# Altium schematic sheet Atmega328P.SchDoc
size A4
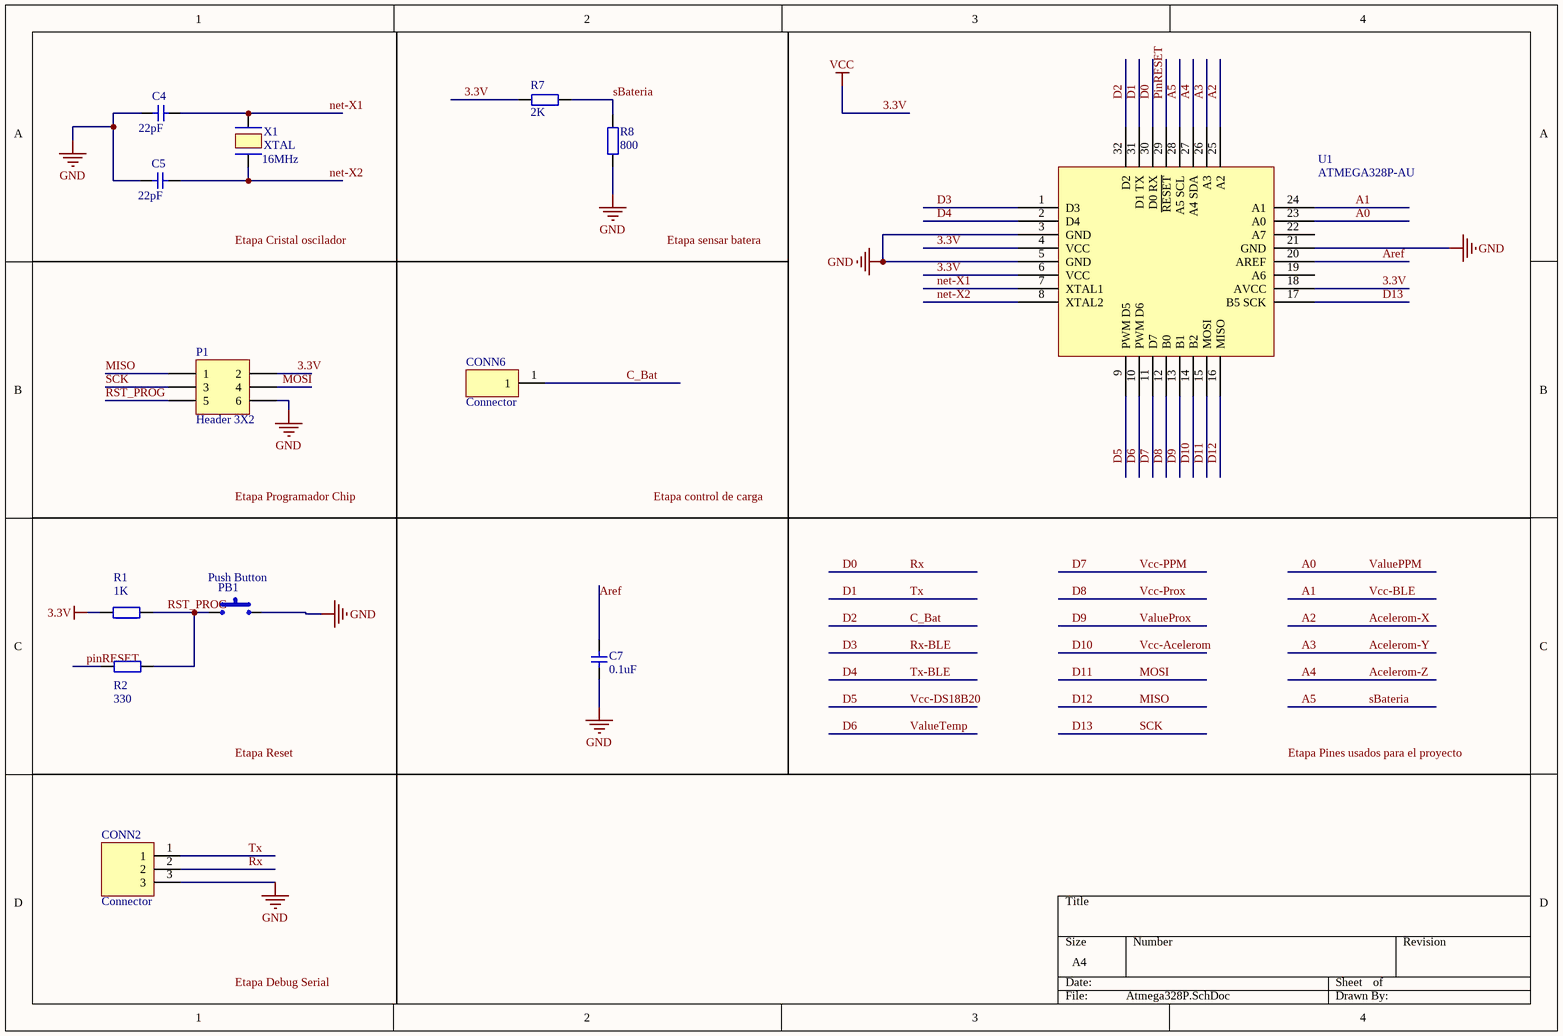
[diagram p0: Atmega328P.SchDoc]

## Parts
C4  value 22pF  [C1206-1.25]  (hidden comment: C1)
C5  value 22pF  [C1206-1.25]  (hidden comment: C2)
C7  value 0.1uF  [C1206-1.25]  (hidden comment: C2)
CONN2  Connector  [1x3x2.54 Pin Header TH V]
CONN6  Connector  [1x1x2.54 Pin Header TH V]
P1  Header 3X2  [HDR2X3]
PB1  Push Button  [Tack Switch 6x6 1mm TH]
R1  value 1K  [R1206-0.55]  (hidden comment: R)
R2  value 330  [R1206-0.55]  (hidden comment: R)
R7  value 2K  [R1206-0.55]  (hidden comment: R)
R8  value 800  [R1206-0.55]  (hidden comment: R)
U1  ATMEGA328P-AU  [TQFP80P900X900X120-32N]
X1  XTAL  value 16MHz  [2-SMD]

## Nets
3.3V: P1.2 R1.1 R7.2 U1.4(VCC) U1.6(VCC) U1.18(AVCC)  [also labelled VCC]
GND: C4.1 C5.1 C7.1 CONN2.3 P1.6 PB1.2 R8.1 U1.3(GND) U1.5(GND) U1.21(GND)
A0: U1.23(A0)  [also labelled ValuePPM]
A1: U1.24(A1)  [also labelled Vcc-BLE]
A2: U1.25(A2)  [also labelled Acelerom-X]
A3: U1.26(A3)  [also labelled Acelerom-Y]
A4: U1.27(A4_SDA)  [also labelled Acelerom-Z]
A5: R7.1 R8.2 U1.28(A5_SCL)  [also labelled sBateria]
Aref: C7.2 U1.20(AREF)
C_Bat: CONN6.1 U1.32(D2)  [also labelled D2]
D0: CONN2.2 U1.30(D0_RX)  [also labelled Rx]
D1: CONN2.1 U1.31(D1_TX)  [also labelled Tx]
D3: U1.1(D3)  [also labelled Rx-BLE]
D4: U1.2(D4)  [also labelled Tx-BLE]
D5: U1.9(PWM_D5)  [also labelled Vcc-DS18B20]
D6: U1.10(PWM_D6)  [also labelled ValueTemp]
D7: U1.11(D7)  [also labelled Vcc-PPM]
D8: U1.12(B0)  [also labelled Vcc-Prox]
D9: U1.13(B1)  [also labelled ValueProx]
D10: U1.14(B2)  [also labelled Vcc-Acelerom]
D11: P1.4 U1.15(MOSI)  [also labelled MOSI]
D12: P1.1 U1.16(MISO)  [also labelled MISO]
D13: P1.3 U1.17(B5_SCK)  [also labelled SCK]
net-X1: C4.2 U1.7(XTAL1) X1.2
net-X2: C5.2 U1.8(XTAL2) X1.1
pinRESET: R2.1 U1.29(~{RESET})
RST_PROG: P1.5 PB1.1 R1.2 R2.2

Not connected (* = marked no-connect by the designer): U1 19(A6) 22(A7)

## Notes on the sheet
- Labels drawn without touching a wire or pin: Etapa control de carga, Etapa Cristal oscilador, Etapa Debug Serial, Etapa Pines usados para el proyecto, Etapa Programador Chip, Etapa Reset, Etapa sensar batera

## Library data of the parts
C4 C5 C7 = C: Capacitor, generic
CONN2 = Header 1x3: Rx / Tx
CONN6 = Header 1x1: Sen Batery
P1 = Header 3X2: Header, 3-Pin, Dual row; LatestRevisionDate: 17-Jul-2002; LatestRevisionNote: Re-released for DXP Platform.; Publisher: Altium Limited
R1 R2 R7 R8 = R: Resistor, generic
U1 = ATMEGA328P-AU: Microchip Technology ATMEGA328P-AN, 8bit AVR Microcontroller, 20MHz, 32 kB Flash, 32-Pin TQFP; Company: Gueni; Created By: Mohamed Gueni; Date: 20 October 2018; RS Stock No: 131-0271; Datasheet URL: https://docs-emea.rs-online.com/webdocs/15b8/0900766b815b8e7b.pdf
X1 = XTAL: Crystal, Generic